# Altium schematic sheet BMS_top_level.SchDoc
size A; SheetNumber: 1; SheetTotal: 9
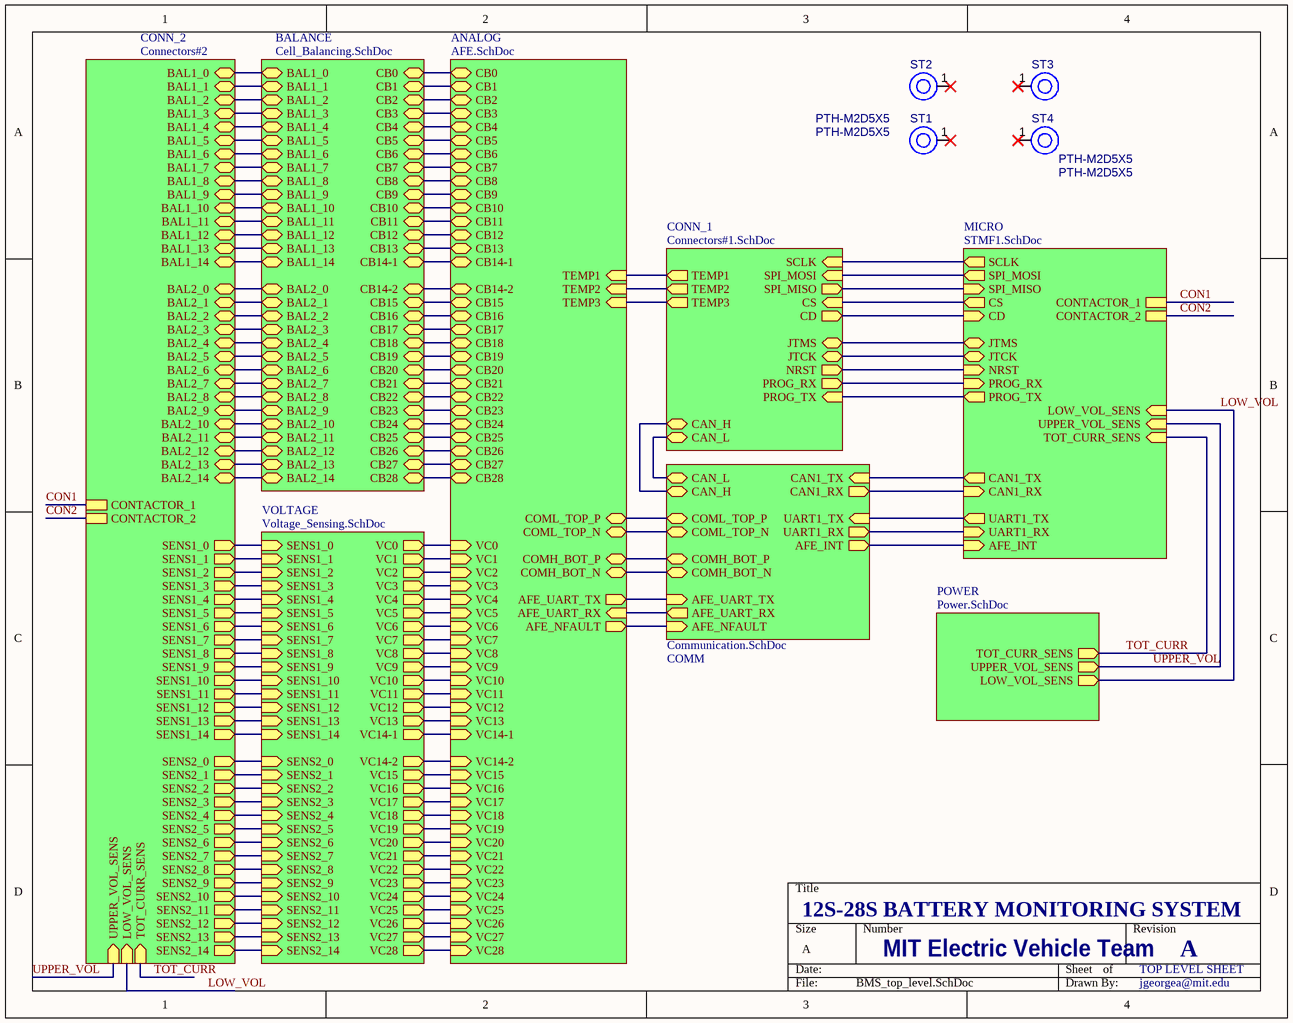
[diagram p0: BMS_top_level.SchDoc]

## Parts
ST1  PTH-M2D5X5  [PTH-M2D5X5]
ST2  PTH-M2D5X5  [PTH-M2D5X5]
ST3  PTH-M2D5X5  [PTH-M2D5X5]
ST4  PTH-M2D5X5  [PTH-M2D5X5]

## Sub-sheets
ANALOG = AFE.SchDoc: COMH_BOT_P (bidir), COMH_BOT_N (bidir), COML_TOP_N (bidir), COML_TOP_P (bidir), CB0 (bidir), CB1 (bidir), CB2 (bidir), CB3 (bidir), CB4 (bidir), CB5 (bidir), CB6 (bidir), CB7 (bidir), CB8 (bidir), CB9 (bidir), CB10 (bidir), CB11 (bidir), CB12 (bidir), CB13 (bidir), CB14-1 (bidir), VC0 (in), VC1 (in), VC2 (in), VC3 (in), VC4 (in), VC5 (in), VC6 (in), VC7 (in), VC8 (in), VC9 (in), VC10 (in), VC11 (in), VC12 (in), VC13 (in), VC14-1 (in), CB14-2 (bidir), CB15 (bidir), CB16 (bidir), CB17 (bidir), CB18 (bidir), CB19 (bidir), CB20 (bidir), CB21 (bidir), CB22 (bidir), CB23 (bidir), CB24 (bidir), CB25 (bidir), CB26 (bidir), CB27 (bidir), CB28 (bidir), VC14-2 (in), VC15 (in), VC16 (in), VC17 (in), VC18 (in), VC19 (in), VC20 (in), VC21 (in), VC22 (in), VC23 (in), VC24 (in), VC25 (in), VC26 (in), VC27 (in), VC28 (in), AFE_UART_TX (out), AFE_UART_RX (in), AFE_NFAULT (out), TEMP1 (in), TEMP2 (in), TEMP3 (in)
BALANCE = Cell_Balancing.SchDoc: CB0 (bidir), CB1 (bidir), CB2 (bidir), CB3 (bidir), CB4 (bidir), CB5 (bidir), CB6 (bidir), CB7 (bidir), CB8 (bidir), CB9 (bidir), CB10 (bidir), CB11 (bidir), CB12 (bidir), CB13 (bidir), CB14-1 (bidir), CB14-2 (bidir), CB15 (bidir), CB16 (bidir), CB17 (bidir), CB18 (bidir), CB19 (bidir), CB20 (bidir), CB21 (bidir), CB22 (bidir), CB23 (bidir), CB24 (bidir), CB25 (bidir), CB26 (bidir), CB27 (bidir), CB28 (bidir), BAL1_0 (bidir), BAL1_1 (bidir), BAL1_2 (bidir), BAL1_3 (bidir), BAL1_4 (bidir), BAL1_5 (bidir), BAL1_6 (bidir), BAL1_7 (bidir), BAL1_8 (bidir), BAL1_9 (bidir), BAL1_10 (bidir), BAL1_11 (bidir), BAL1_12 (bidir), BAL1_13 (bidir), BAL1_14 (bidir), BAL2_0 (bidir), BAL2_1 (bidir), BAL2_2 (bidir), BAL2_3 (bidir), BAL2_4 (bidir), BAL2_5 (bidir), BAL2_6 (bidir), BAL2_7 (bidir), BAL2_8 (bidir), BAL2_9 (bidir), BAL2_10 (bidir), BAL2_11 (bidir), BAL2_12 (bidir), BAL2_13 (bidir), BAL2_14 (bidir)
COMM = Communication.SchDoc: CAN_H (bidir), CAN_L (bidir), CAN1_RX (out), CAN1_TX (in), COMH_BOT_P (bidir), COMH_BOT_N (bidir), COML_TOP_P (bidir), COML_TOP_N (bidir), AFE_UART_TX (in), UART1_RX (out), UART1_TX (in), AFE_UART_RX (out), AFE_NFAULT (in), AFE_INT (out)
CONN_1 = Connectors#1.SchDoc: SPI_MISO (out), SCLK (in), SPI_MOSI (in), CS (in), PROG_RX (out), PROG_TX (in), NRST (out), JTCK (bidir), JTMS (bidir), CAN_H (bidir), CAN_L (bidir), CD (out), TEMP1 (out), TEMP2 (out), TEMP3 (out)
CONN_2 = Connectors#2: SENS1_0 (out), SENS1_1 (out), SENS1_2 (out), SENS1_3 (out), SENS1_4 (out), SENS1_5 (out), SENS1_6 (out), SENS1_7 (out), SENS1_8 (out), SENS1_9 (out), SENS1_10 (out), SENS1_11 (out), SENS1_12 (out), SENS1_13 (out), SENS1_14 (out), SENS2_0 (out), SENS2_1 (out), SENS2_2 (out), SENS2_3 (out), SENS2_4 (out), SENS2_5 (out), SENS2_6 (out), SENS2_7 (out), SENS2_8 (out), SENS2_9 (out), SENS2_10 (out), SENS2_11 (out), SENS2_12 (out), SENS2_13 (out), SENS2_14 (out), BAL1_0 (bidir), BAL1_1 (bidir), BAL1_2 (bidir), BAL1_3 (bidir), BAL1_4 (bidir), BAL1_5 (bidir), BAL1_6 (bidir), BAL1_7 (bidir), BAL1_8 (bidir), BAL1_9 (bidir), BAL1_10 (bidir), BAL1_11 (bidir), BAL1_12 (bidir), BAL1_13 (bidir), BAL1_14 (bidir), BAL2_0 (bidir), BAL2_1 (bidir), BAL2_2 (bidir), BAL2_3 (bidir), BAL2_4 (bidir), BAL2_5 (bidir), BAL2_6 (bidir), BAL2_7 (bidir), BAL2_8 (bidir), BAL2_9 (bidir), BAL2_10 (bidir), BAL2_11 (bidir), BAL2_12 (bidir), BAL2_13 (bidir), BAL2_14 (bidir), CONTACTOR_2, CONTACTOR_1, UPPER_VOL_SENS (in), LOW_VOL_SENS (in), TOT_CURR_SENS (in)
MICRO = STMF1.SchDoc: NRST (in), SCLK (out), SPI_MISO (in), SPI_MOSI (out), CS (out), UART1_TX (out), UART1_RX (in), CAN1_RX (in), CAN1_TX (out), JTMS (bidir), JTCK (bidir), PROG_RX (in), PROG_TX (out), AFE_INT (in), CD (in), TOT_CURR_SENS (in), CONTACTOR_1, CONTACTOR_2, LOW_VOL_SENS (in), UPPER_VOL_SENS (in)
POWER = Power.SchDoc: TOT_CURR_SENS (out), UPPER_VOL_SENS (out), LOW_VOL_SENS (out)
VOLTAGE = Voltage_Sensing.SchDoc: VC0 (out), VC1 (out), VC2 (out), VC3 (out), VC4 (out), VC5 (out), SENS1_0 (in), VC6 (out), VC7 (out), VC8 (out), VC9 (out), VC10 (out), VC11 (out), VC12 (out), VC13 (out), VC14-1 (out), VC14-2 (out), VC15 (out), VC16 (out), VC17 (out), VC18 (out), VC19 (out), VC20 (out), VC21 (out), VC22 (out), VC23 (out), VC24 (out), VC25 (out), VC26 (out), VC27 (out), VC28 (out), SENS1_1 (in), SENS1_2 (in), SENS1_3 (in), SENS1_4 (in), SENS1_5 (in), SENS1_6 (in), SENS1_7 (in), SENS1_8 (in), SENS1_9 (in), SENS1_10 (in), SENS1_11 (in), SENS1_12 (in), SENS1_13 (in), SENS1_14 (in), SENS2_0 (in), SENS2_1 (in), SENS2_2 (in), SENS2_3 (in), SENS2_4 (in), SENS2_5 (in), SENS2_6 (in), SENS2_7 (in), SENS2_8 (in), SENS2_9 (in), SENS2_10 (in), SENS2_11 (in), SENS2_12 (in), SENS2_13 (in), SENS2_14 (in)

## Nets
CON1: sheet MICRO/CONTACTOR_1, sheet CONN_2/CONTACTOR_1
CON2: sheet MICRO/CONTACTOR_2, sheet CONN_2/CONTACTOR_2
LOW_VOL: sheet MICRO/LOW_VOL_SENS, sheet POWER/LOW_VOL_SENS, sheet CONN_2/LOW_VOL_SENS
TOT_CURR: sheet MICRO/TOT_CURR_SENS, sheet POWER/TOT_CURR_SENS, sheet CONN_2/TOT_CURR_SENS
UPPER_VOL: sheet MICRO/UPPER_VOL_SENS, sheet POWER/UPPER_VOL_SENS, sheet CONN_2/UPPER_VOL_SENS
(unnamed): sheet COMM/CAN_H, sheet CONN_1/CAN_H
(unnamed): sheet COMM/CAN_L, sheet CONN_1/CAN_L
(unnamed): sheet COMM/CAN1_RX, sheet MICRO/CAN1_RX
(unnamed): sheet COMM/CAN1_TX, sheet MICRO/CAN1_TX
(unnamed): sheet COMM/COMH_BOT_P, sheet ANALOG/COMH_BOT_P
(unnamed): sheet COMM/COMH_BOT_N, sheet ANALOG/COMH_BOT_N
(unnamed): sheet COMM/COML_TOP_P, sheet ANALOG/COML_TOP_P
(unnamed): sheet COMM/COML_TOP_N, sheet ANALOG/COML_TOP_N
(unnamed): sheet COMM/AFE_UART_TX, sheet ANALOG/AFE_UART_TX
(unnamed): sheet COMM/UART1_RX, sheet MICRO/UART1_RX
(unnamed): sheet COMM/UART1_TX, sheet MICRO/UART1_TX
(unnamed): sheet COMM/AFE_UART_RX, sheet ANALOG/AFE_UART_RX
(unnamed): sheet COMM/AFE_NFAULT, sheet ANALOG/AFE_NFAULT
(unnamed): sheet COMM/AFE_INT, sheet MICRO/AFE_INT
(unnamed): sheet MICRO/NRST, sheet CONN_1/NRST
(unnamed): sheet MICRO/SCLK, sheet CONN_1/SCLK
(unnamed): sheet MICRO/SPI_MISO, sheet CONN_1/SPI_MISO
(unnamed): sheet MICRO/SPI_MOSI, sheet CONN_1/SPI_MOSI
(unnamed): sheet MICRO/CS, sheet CONN_1/CS
(unnamed): sheet MICRO/JTMS, sheet CONN_1/JTMS
(unnamed): sheet MICRO/JTCK, sheet CONN_1/JTCK
(unnamed): sheet MICRO/PROG_RX, sheet CONN_1/PROG_RX
(unnamed): sheet MICRO/PROG_TX, sheet CONN_1/PROG_TX
(unnamed): sheet MICRO/CD, sheet CONN_1/CD
(unnamed): sheet CONN_1/TEMP1, sheet ANALOG/TEMP1
(unnamed): sheet CONN_1/TEMP2, sheet ANALOG/TEMP2
(unnamed): sheet CONN_1/TEMP3, sheet ANALOG/TEMP3
(unnamed): sheet ANALOG/CB0, sheet BALANCE/CB0
(unnamed): sheet ANALOG/CB1, sheet BALANCE/CB1
(unnamed): sheet ANALOG/CB2, sheet BALANCE/CB2
(unnamed): sheet ANALOG/CB3, sheet BALANCE/CB3
(unnamed): sheet ANALOG/CB4, sheet BALANCE/CB4
(unnamed): sheet ANALOG/CB5, sheet BALANCE/CB5
(unnamed): sheet ANALOG/CB6, sheet BALANCE/CB6
(unnamed): sheet ANALOG/CB7, sheet BALANCE/CB7
(unnamed): sheet ANALOG/CB8, sheet BALANCE/CB8
(unnamed): sheet ANALOG/CB9, sheet BALANCE/CB9
(unnamed): sheet ANALOG/CB10, sheet BALANCE/CB10
(unnamed): sheet ANALOG/CB11, sheet BALANCE/CB11
(unnamed): sheet ANALOG/CB12, sheet BALANCE/CB12
(unnamed): sheet ANALOG/CB13, sheet BALANCE/CB13
(unnamed): sheet ANALOG/CB14-1, sheet BALANCE/CB14-1
(unnamed): sheet ANALOG/VC0, sheet VOLTAGE/VC0
(unnamed): sheet ANALOG/VC1, sheet VOLTAGE/VC1
(unnamed): sheet ANALOG/VC2, sheet VOLTAGE/VC2
(unnamed): sheet ANALOG/VC3, sheet VOLTAGE/VC3
(unnamed): sheet ANALOG/VC4, sheet VOLTAGE/VC4
(unnamed): sheet ANALOG/VC5, sheet VOLTAGE/VC5
(unnamed): sheet ANALOG/VC6, sheet VOLTAGE/VC6
(unnamed): sheet ANALOG/VC7, sheet VOLTAGE/VC7
(unnamed): sheet ANALOG/VC8, sheet VOLTAGE/VC8
(unnamed): sheet ANALOG/VC9, sheet VOLTAGE/VC9
(unnamed): sheet ANALOG/VC10, sheet VOLTAGE/VC10
(unnamed): sheet ANALOG/VC11, sheet VOLTAGE/VC11
(unnamed): sheet ANALOG/VC12, sheet VOLTAGE/VC12
(unnamed): sheet ANALOG/VC13, sheet VOLTAGE/VC13
(unnamed): sheet ANALOG/VC14-1, sheet VOLTAGE/VC14-1
(unnamed): sheet ANALOG/CB14-2, sheet BALANCE/CB14-2
(unnamed): sheet ANALOG/CB15, sheet BALANCE/CB15
(unnamed): sheet ANALOG/CB16, sheet BALANCE/CB16
(unnamed): sheet ANALOG/CB17, sheet BALANCE/CB17
(unnamed): sheet ANALOG/CB18, sheet BALANCE/CB18
(unnamed): sheet ANALOG/CB19, sheet BALANCE/CB19
(unnamed): sheet ANALOG/CB20, sheet BALANCE/CB20
(unnamed): sheet ANALOG/CB21, sheet BALANCE/CB21
(unnamed): sheet ANALOG/CB22, sheet BALANCE/CB22
(unnamed): sheet ANALOG/CB23, sheet BALANCE/CB23
(unnamed): sheet ANALOG/CB24, sheet BALANCE/CB24
(unnamed): sheet ANALOG/CB25, sheet BALANCE/CB25
(unnamed): sheet ANALOG/CB26, sheet BALANCE/CB26
(unnamed): sheet ANALOG/CB27, sheet BALANCE/CB27
(unnamed): sheet ANALOG/CB28, sheet BALANCE/CB28
(unnamed): sheet ANALOG/VC14-2, sheet VOLTAGE/VC14-2
(unnamed): sheet ANALOG/VC15, sheet VOLTAGE/VC15
(unnamed): sheet ANALOG/VC16, sheet VOLTAGE/VC16
(unnamed): sheet ANALOG/VC17, sheet VOLTAGE/VC17
(unnamed): sheet ANALOG/VC18, sheet VOLTAGE/VC18
(unnamed): sheet ANALOG/VC19, sheet VOLTAGE/VC19
(unnamed): sheet ANALOG/VC20, sheet VOLTAGE/VC20
(unnamed): sheet ANALOG/VC21, sheet VOLTAGE/VC21
(unnamed): sheet ANALOG/VC22, sheet VOLTAGE/VC22
(unnamed): sheet ANALOG/VC23, sheet VOLTAGE/VC23
(unnamed): sheet ANALOG/VC24, sheet VOLTAGE/VC24
(unnamed): sheet ANALOG/VC25, sheet VOLTAGE/VC25
(unnamed): sheet ANALOG/VC26, sheet VOLTAGE/VC26
(unnamed): sheet ANALOG/VC27, sheet VOLTAGE/VC27
(unnamed): sheet ANALOG/VC28, sheet VOLTAGE/VC28
(unnamed): sheet BALANCE/BAL1_0, sheet CONN_2/BAL1_0
(unnamed): sheet BALANCE/BAL1_1, sheet CONN_2/BAL1_1
(unnamed): sheet BALANCE/BAL1_2, sheet CONN_2/BAL1_2
(unnamed): sheet BALANCE/BAL1_3, sheet CONN_2/BAL1_3
(unnamed): sheet BALANCE/BAL1_4, sheet CONN_2/BAL1_4
(unnamed): sheet BALANCE/BAL1_5, sheet CONN_2/BAL1_5
(unnamed): sheet BALANCE/BAL1_6, sheet CONN_2/BAL1_6
(unnamed): sheet BALANCE/BAL1_7, sheet CONN_2/BAL1_7
(unnamed): sheet BALANCE/BAL1_8, sheet CONN_2/BAL1_8
(unnamed): sheet BALANCE/BAL1_9, sheet CONN_2/BAL1_9
(unnamed): sheet BALANCE/BAL1_10, sheet CONN_2/BAL1_10
(unnamed): sheet BALANCE/BAL1_11, sheet CONN_2/BAL1_11
(unnamed): sheet BALANCE/BAL1_12, sheet CONN_2/BAL1_12
(unnamed): sheet BALANCE/BAL1_13, sheet CONN_2/BAL1_13
(unnamed): sheet BALANCE/BAL1_14, sheet CONN_2/BAL1_14
(unnamed): sheet BALANCE/BAL2_0, sheet CONN_2/BAL2_0
(unnamed): sheet BALANCE/BAL2_1, sheet CONN_2/BAL2_1
(unnamed): sheet BALANCE/BAL2_2, sheet CONN_2/BAL2_2
(unnamed): sheet BALANCE/BAL2_3, sheet CONN_2/BAL2_3
(unnamed): sheet BALANCE/BAL2_4, sheet CONN_2/BAL2_4
(unnamed): sheet BALANCE/BAL2_5, sheet CONN_2/BAL2_5
(unnamed): sheet BALANCE/BAL2_6, sheet CONN_2/BAL2_6
(unnamed): sheet BALANCE/BAL2_7, sheet CONN_2/BAL2_7
(unnamed): sheet BALANCE/BAL2_8, sheet CONN_2/BAL2_8
(unnamed): sheet BALANCE/BAL2_9, sheet CONN_2/BAL2_9
(unnamed): sheet BALANCE/BAL2_10, sheet CONN_2/BAL2_10
(unnamed): sheet BALANCE/BAL2_11, sheet CONN_2/BAL2_11
(unnamed): sheet BALANCE/BAL2_12, sheet CONN_2/BAL2_12
(unnamed): sheet BALANCE/BAL2_13, sheet CONN_2/BAL2_13
(unnamed): sheet BALANCE/BAL2_14, sheet CONN_2/BAL2_14
(unnamed): sheet VOLTAGE/SENS1_0, sheet CONN_2/SENS1_0
(unnamed): sheet VOLTAGE/SENS1_1, sheet CONN_2/SENS1_1
(unnamed): sheet VOLTAGE/SENS1_2, sheet CONN_2/SENS1_2
(unnamed): sheet VOLTAGE/SENS1_3, sheet CONN_2/SENS1_3
(unnamed): sheet VOLTAGE/SENS1_4, sheet CONN_2/SENS1_4
(unnamed): sheet VOLTAGE/SENS1_5, sheet CONN_2/SENS1_5
(unnamed): sheet VOLTAGE/SENS1_6, sheet CONN_2/SENS1_6
(unnamed): sheet VOLTAGE/SENS1_7, sheet CONN_2/SENS1_7
(unnamed): sheet VOLTAGE/SENS1_8, sheet CONN_2/SENS1_8
(unnamed): sheet VOLTAGE/SENS1_9, sheet CONN_2/SENS1_9
(unnamed): sheet VOLTAGE/SENS1_10, sheet CONN_2/SENS1_10
(unnamed): sheet VOLTAGE/SENS1_11, sheet CONN_2/SENS1_11
(unnamed): sheet VOLTAGE/SENS1_12, sheet CONN_2/SENS1_12
(unnamed): sheet VOLTAGE/SENS1_13, sheet CONN_2/SENS1_13
(unnamed): sheet VOLTAGE/SENS1_14, sheet CONN_2/SENS1_14
(unnamed): sheet VOLTAGE/SENS2_0, sheet CONN_2/SENS2_0
(unnamed): sheet VOLTAGE/SENS2_1, sheet CONN_2/SENS2_1
(unnamed): sheet VOLTAGE/SENS2_2, sheet CONN_2/SENS2_2
(unnamed): sheet VOLTAGE/SENS2_3, sheet CONN_2/SENS2_3
(unnamed): sheet VOLTAGE/SENS2_4, sheet CONN_2/SENS2_4
(unnamed): sheet VOLTAGE/SENS2_5, sheet CONN_2/SENS2_5
(unnamed): sheet VOLTAGE/SENS2_6, sheet CONN_2/SENS2_6
(unnamed): sheet VOLTAGE/SENS2_7, sheet CONN_2/SENS2_7
(unnamed): sheet VOLTAGE/SENS2_8, sheet CONN_2/SENS2_8
(unnamed): sheet VOLTAGE/SENS2_9, sheet CONN_2/SENS2_9
(unnamed): sheet VOLTAGE/SENS2_10, sheet CONN_2/SENS2_10
(unnamed): sheet VOLTAGE/SENS2_11, sheet CONN_2/SENS2_11
(unnamed): sheet VOLTAGE/SENS2_12, sheet CONN_2/SENS2_12
(unnamed): sheet VOLTAGE/SENS2_13, sheet CONN_2/SENS2_13
(unnamed): sheet VOLTAGE/SENS2_14, sheet CONN_2/SENS2_14

Not connected (* = marked no-connect by the designer): ST1 1(H1)*; ST2 1(H1)*; ST3 1(H1)*; ST4 1(H1)*

## Notes on the sheet
- 12S-28S BATTERY MONITORING SYSTEM
- MIT Electric Vehicle Team
- TOP LEVEL SHEET
- A
- jgeorgea@mit.edu

## Library data of the parts
ST1-ST4 = CMP-00028-00004-2: M2 PTH (2.5mm), 5mm pad; Pins: 1